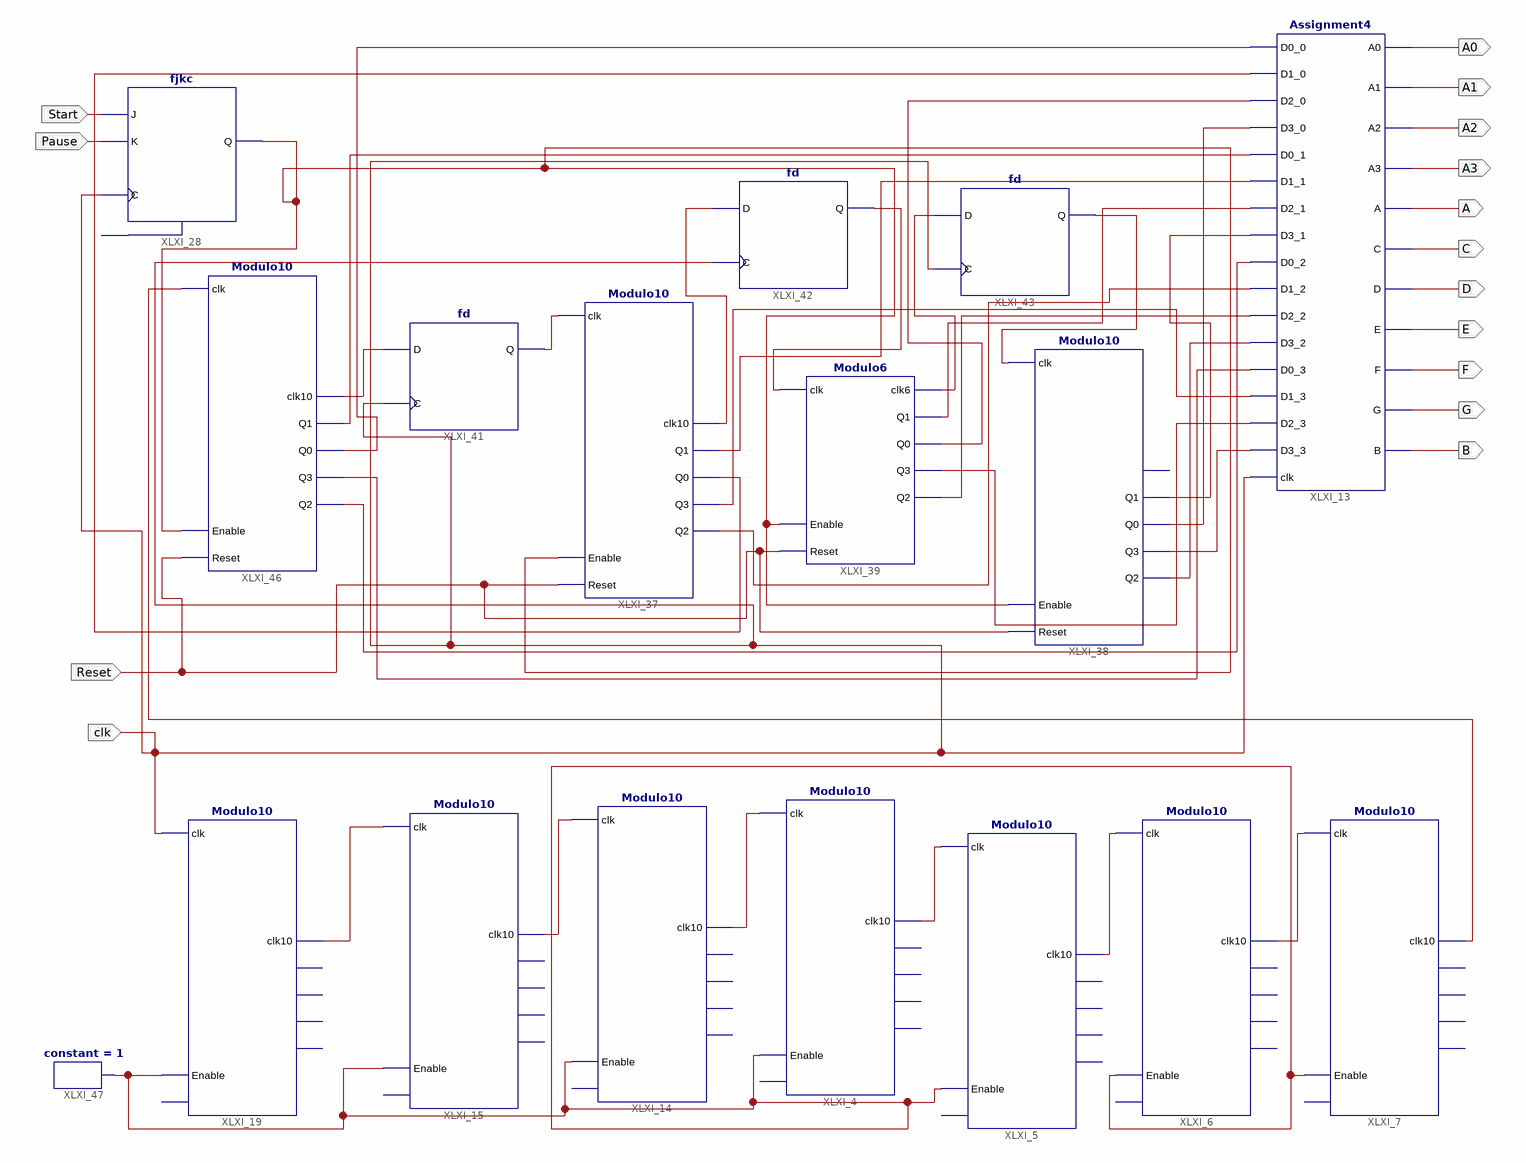
[diagram p0: schematic sheet 1]
// Xilinx ISE schematic Assign5.sch (spartan6) as structural Verilog: 17 symbols, 15 ports
module Assign5 (
  input  clk,
  input  Start,
  input  Pause,
  input  Reset,
  output A0,
  output A1,
  output A2,
  output A3,
  output A,
  output C,
  output D,
  output E,
  output F,
  output G,
  output B
);

  wire XLXN_4, XLXN_5, XLXN_6, XLXN_55, XLXN_56, XLXN_57, XLXN_107, XLXN_109, XLXN_112, XLXN_113, XLXN_114,
       XLXN_141, XLXN_144, XLXN_145, XLXN_146, XLXN_147, XLXN_148, XLXN_149, XLXN_150, XLXN_151, XLXN_152,
       XLXN_153, XLXN_154, XLXN_157, XLXN_167, XLXN_189, XLXN_190, XLXN_191, XLXN_192, XLXN_193, XLXN_198;

  Modulo10 XLXI_7 (.clk(XLXN_6), .clk10(XLXN_107), .Enable(XLXN_198));  // open: Q1, Q3, Q2, Q0, Reset
  Modulo10 XLXI_6 (.clk(XLXN_5), .clk10(XLXN_6), .Enable(XLXN_198));  // open: Q1, Q3, Q2, Q0, Reset
  Modulo10 XLXI_5 (.clk(XLXN_4), .clk10(XLXN_5), .Enable(XLXN_198));  // open: Q1, Q3, Q2, Q0, Reset
  Modulo10 XLXI_14 (.clk(XLXN_56), .clk10(XLXN_55), .Enable(XLXN_198));  // open: Q1, Q3, Q2, Q0, Reset
  Modulo10 XLXI_15 (.clk(XLXN_57), .clk10(XLXN_56), .Enable(XLXN_198));  // open: Q1, Q3, Q2, Q0, Reset
  Modulo10 XLXI_4 (.clk(XLXN_55), .clk10(XLXN_4), .Enable(XLXN_198));  // open: Q1, Q3, Q2, Q0, Reset
  Modulo10 XLXI_19 (.clk(clk), .clk10(XLXN_57), .Enable(XLXN_198));  // open: Q1, Q3, Q2, Q0, Reset
  fjkc XLXI_28 (.C(clk), .J(Start), .K(Pause), .Q(XLXN_193));  // open: CLR
  Modulo10 XLXI_38 (
    .clk(XLXN_114), .Q1(XLXN_152), .Q3(XLXN_154), .Q2(XLXN_157), .Q0(XLXN_153), .Enable(XLXN_193),
    .Reset(Reset));  // open: clk10
  Modulo6 XLXI_39 (
    .clk(XLXN_112), .Q1(XLXN_148), .Q3(XLXN_150), .Q2(XLXN_151), .clk6(XLXN_113), .Q0(XLXN_149),
    .Enable(XLXN_193), .Reset(Reset));
  fd XLXI_41 (.C(clk), .D(XLXN_189), .Q(XLXN_109));
  fd XLXI_42 (.C(clk), .D(XLXN_167), .Q(XLXN_112));
  fd XLXI_43 (.C(clk), .D(XLXN_113), .Q(XLXN_114));
  Assignment4 XLXI_13 (
    .D0_0(XLXN_141), .D1_0(XLXN_145), .D2_0(XLXN_149), .D3_0(XLXN_153), .D0_1(XLXN_190), .D1_1(XLXN_144),
    .D2_1(XLXN_148), .D3_1(XLXN_152), .D0_2(XLXN_192), .D1_2(XLXN_147), .D2_2(XLXN_151), .D3_2(XLXN_157),
    .D0_3(XLXN_191), .D1_3(XLXN_146), .D2_3(XLXN_150), .D3_3(XLXN_154), .clk(clk), .A0(A0), .A1(A1), .A2(A2),
    .A3(A3), .A(A), .C(C), .D(D), .E(E), .F(F), .G(G), .B(B));
  Modulo10 XLXI_37 (
    .clk(XLXN_109), .Q1(XLXN_144), .Q3(XLXN_146), .Q2(XLXN_147), .clk10(XLXN_167), .Q0(XLXN_145),
    .Enable(XLXN_193), .Reset(Reset));
  Modulo10 XLXI_46 (
    .clk(XLXN_107), .Q1(XLXN_190), .Q3(XLXN_191), .Q2(XLXN_192), .clk10(XLXN_189), .Q0(XLXN_141),
    .Enable(XLXN_193), .Reset(Reset));
  constant #(.CValue("1")) XLXI_47 (.O(XLXN_198));
endmodule
